# EAGLE design 10F 2V7 supercap (EAGLE 5.06)
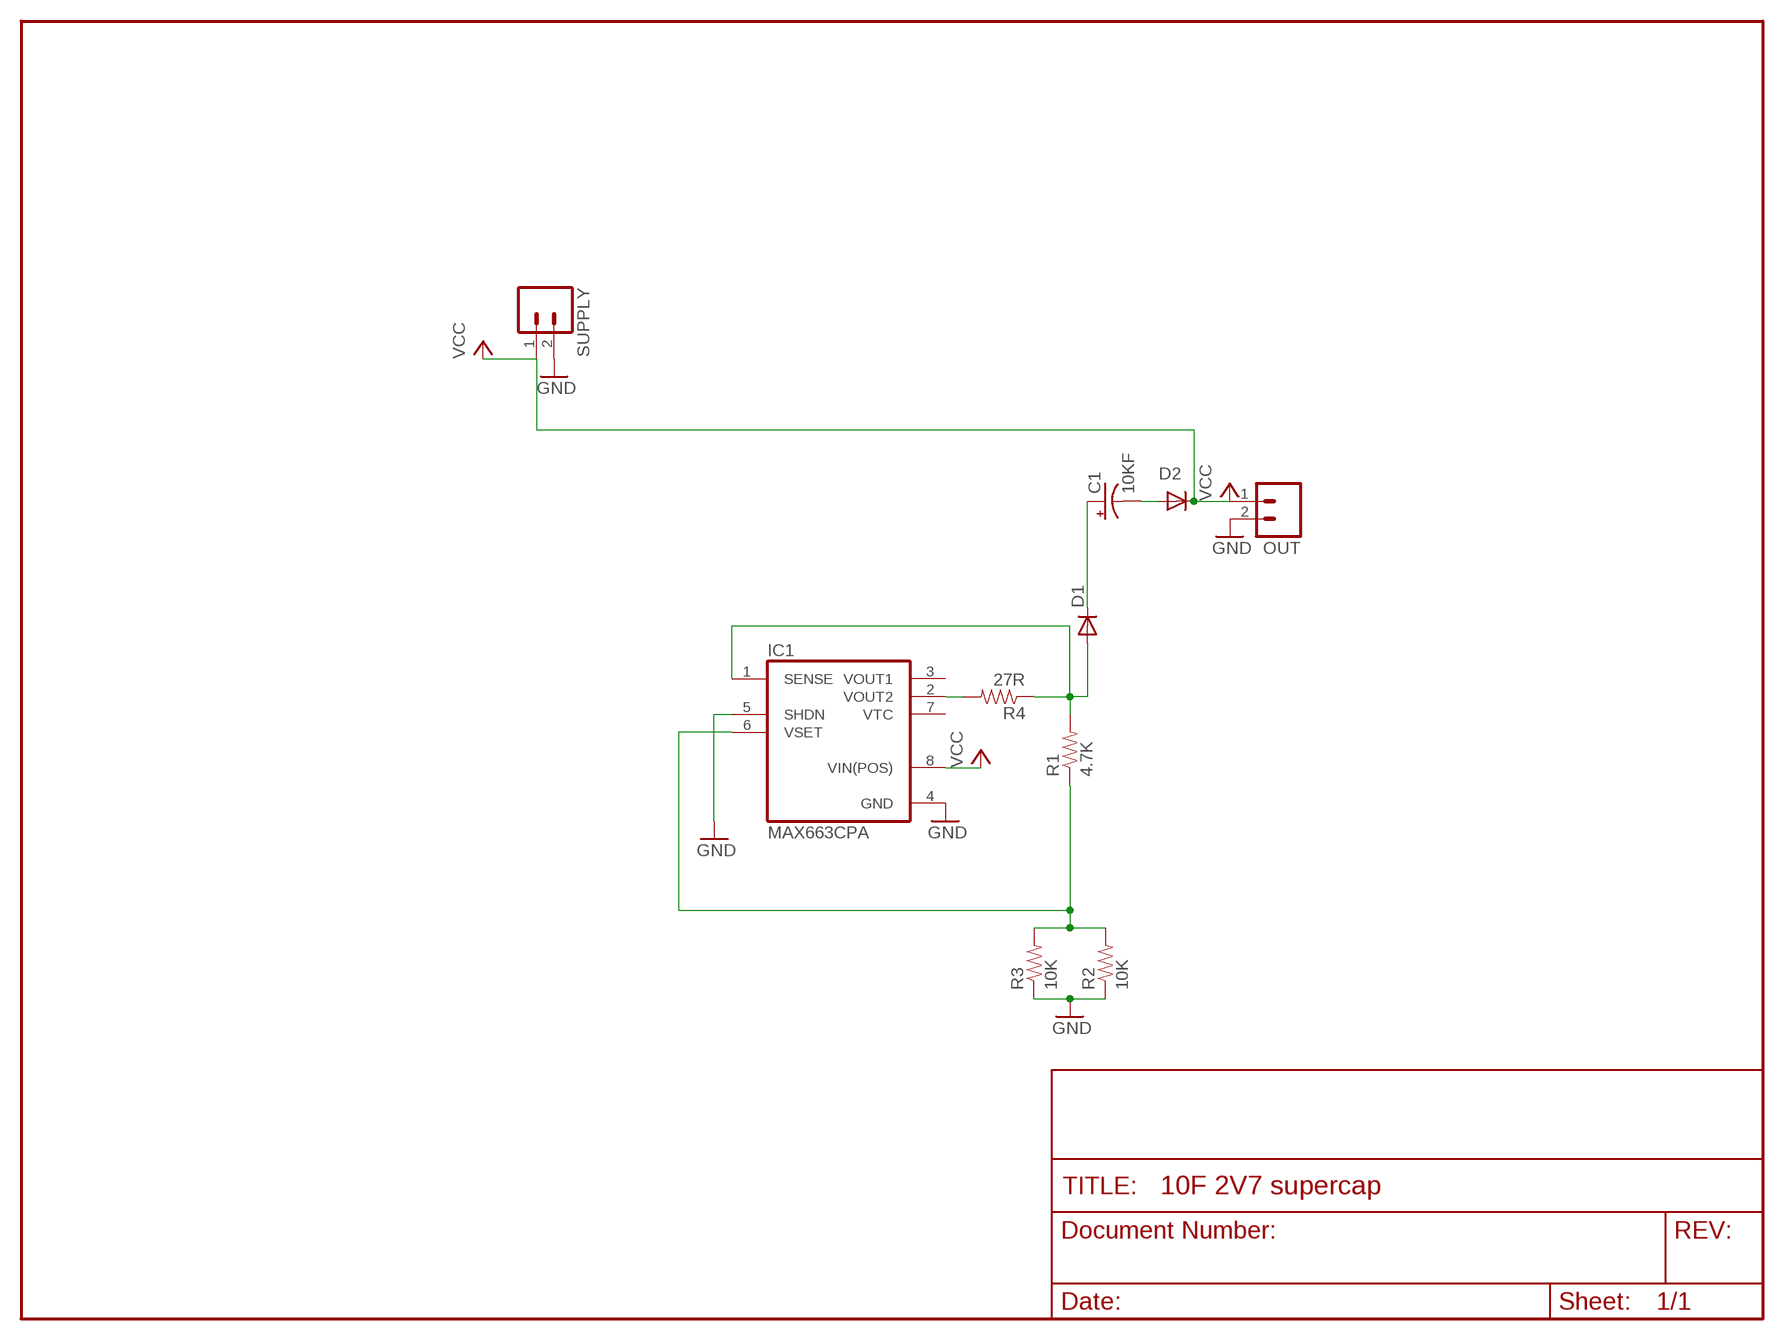
[diagram p0: schematic, sheet 1]

## Parts
C1  10KF  CAP_POLPTH3  [CPOL-RADIAL-1000UF-63V]
D1  DIODEPTH  [DIODE-1N4001]
D2  DIODEPTH  [DIODE-1N4001]
IC1  MAX663CPA  [DIL08]
OUT  M02LOCK  [1X02_LOCK]
R1  4.7K  RESISTORPTH1  [AXIAL-0.3]
R2  10K  RESISTORPTH1  [AXIAL-0.3]
R3  10K  RESISTORPTH1  [AXIAL-0.3]
R4  27R  RESISTORPTH1  [AXIAL-0.3]
SUPPLY  M02LOCK  [1X02_LOCK]

## Nets
GND: IC1.4(GND) IC1.5(SHDN) OUT.2 R2.P$1 R3.P$1 SUPPLY.2
N$1: IC1.2(VOUT2) R4.P$2
N$2: D1.A IC1.1(SENSE) R1.P$2 R4.P$1
N$3: C1.2(-) D2.A
N$4: IC1.6(VSET) R1.P$1 R2.P$2 R3.P$2
N$5: C1.1(+) D1.C
VCC: D2.C IC1.8(VIN(POS)) OUT.1 SUPPLY.1
Unconnected: IC1.3(VOUT1) IC1.7(VTC)

## Library data of the parts
C1 = SparkFun:CAP_POL: Capacitor Polarized These are standard SMD and PTH capacitors. Normally 10uF, 47uF, and 100uF in electrolytic and tantalum varieties. Always verify the external diameter of the through hole cap, it varies with capacity, voltage, and manufacturer. The EIA devices should be standard.
D1 D2 = SparkFun:DIODE: Diode These are standard reverse protection diodes and small signal diodes. SMA package can handle up to about 1A. SOD-323 can handle about 200mA. What the SOD-323 package when ordering, there are some mfgs out there that are 5-pin packages.
IC1 = maxim:MAX663CPA: Positive VOLTAGE REGULATOR
OUT SUPPLY = SparkFun:M02: Header 2 Standard 2-pin 0.1" header. Use with straight break away headers (SKU : PRT-00116), right angle break away headers (PRT-00553), swiss pins (PRT-00743), machine pins (PRT-00117), and female headers (PRT-00115). Molex polarized connector foot print use with SKU : PRT-08233 with associated crimp pins and housings.
R1-R4 = SparkFun:RESISTOR: Resistor Basic schematic elements and footprints for 0603, 1206, and PTH 1/10th watt (small) resistors.

## Board
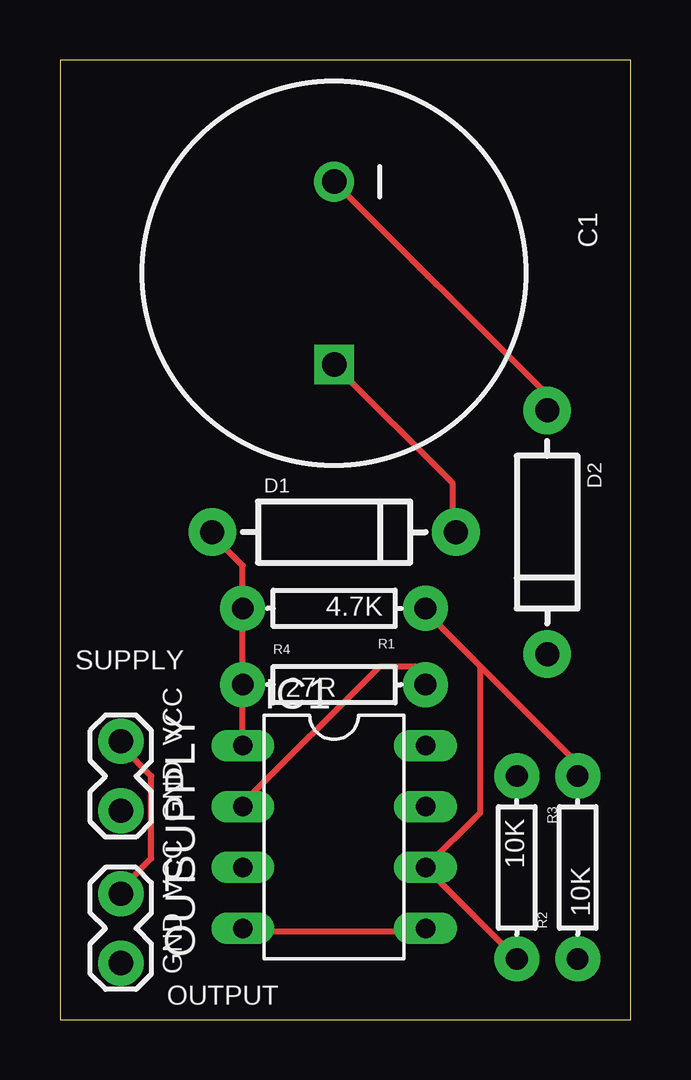
[diagram p1: board, top side]
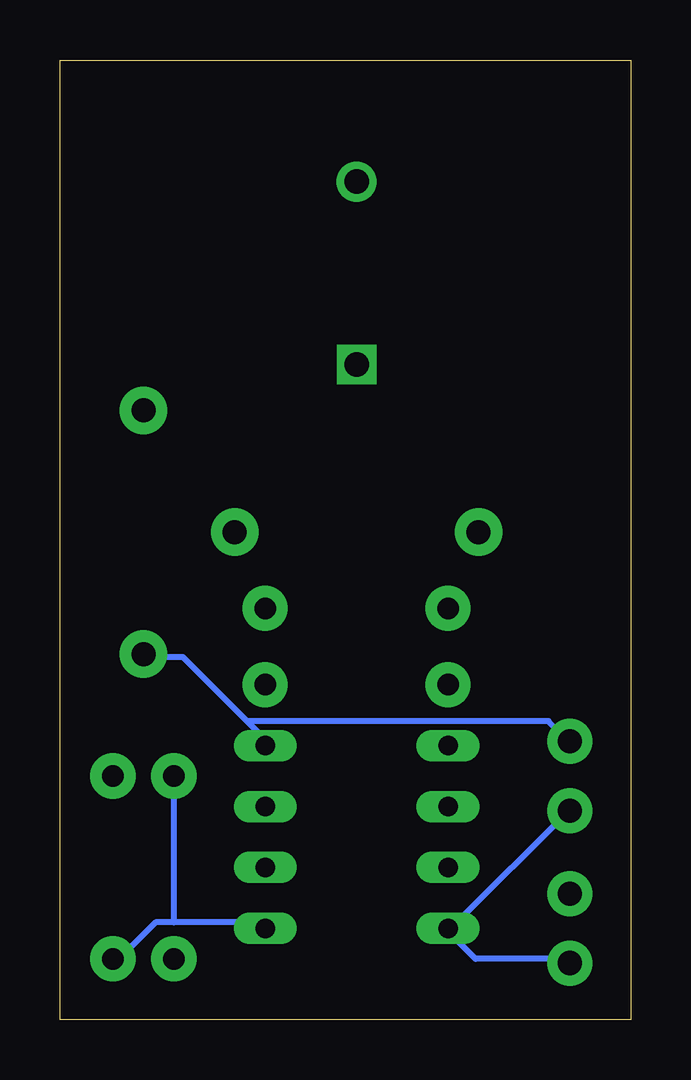
[diagram p2: board, bottom side, seen from below]

Size 23.8 x 39.99 mm. Coordinates in mm from the lower left corner, seen from the top.
Outline: 0,0 23.8,0 23.8,39.99 0,39.99 0,0
Copper layers (1*16): Top 0.035mm / dielectric 1.5mm / Bottom 0.035mm
Design rules "default": minimum track width 10mil, minimum drill 24mil, track to track 8mil, track to pad 8mil, pad to pad 8mil, via to via 8mil, smd to smd 8mil, copper to edge 40mil, drill to drill 8mil, minimum pad ring 10mil, minimum via ring 8mil, stop-mask expansion 4mil, vias tented up to drill 0mil, thermal gap 10mil

### Footprints (pad centres in the part's own frame; a part is rotated, then mirrored left to right if it is on the bottom)
CPOL-RADIAL-1000UF-63V = drill 1.016 pad 1.651 square: 1 3.81,0 | drill 1.016 pad 1.676 round: 2 -3.81,0
DIODE-1N4001 = drill 1 pad 1.981 round: A -5.08,0; C 5.08,0
DIL08 = drill 0.813 long: 1 -3.81,-3.81; 2 -1.27,-3.81; 3 1.27,-3.81; 4 3.81,-3.81; 5 3.81,3.81; 6 1.27,3.81; 7 -1.27,3.81; 8 -3.81,3.81
1X02_LOCK = drill 1.016 pad 1.88 round: 1 -0.178,0; 2 2.718,0
AXIAL-0.3 = drill 0.9 pad 1.88 round: P$1 -3.81,0; P$2 3.81,0

### Placement (x,y rotation side)
C1  11.43,31.11 270 top
D1  11.43,20.32 0 top
D2  20.32,20.32 270 top
IC1  11.43,7.62 270 top
OUT  2.54,5.08 270 top
R1  11.43,17.14 180 top
R2  21.59,6.35 90 top
R3  19.05,6.35 270 top
R4  11.43,13.97 0 top
SUPPLY  2.54,11.43 270 top

### Tracks (layer width: path | path; a pad name or v marks a point on that pad's centre or on a via)
GND
  Top 0.254: IC1.5 15.24,3.68 7.62,3.68 IC1.4
  Bottom 0.254: OUT.2 2.67,2.54 6.48,2.54 7.62,3.68 IC1.4 7.62,4.06 7.24,4.06 2.67,8.64 SUPPLY.2 | 19.05,4.06 15.24,4.06 IC1.5 | 19.05,4.06 19.81,4.06 21.34,2.54 R2.P$1 | 19.05,4.06 R3.P$1
N$1
  Top 0.254: R4.P$2 15.24,14.73 13.34,14.73 7.62,9.02 IC1.2
N$2
  Top 0.254: IC1.1 R4.P$1 R1.P$2 7.62,18.92 6.48,20.07 D1.A
N$3
  Top 0.254: C1.2 20.19,26.16 20.19,25.4 D2.A
N$4
  Top 0.254: R3.P$2 IC1.6 17.53,8.64 17.53,14.73 | 17.53,14.73 21.34,10.92 21.34,10.16 R2.P$2 | 17.53,14.73 15.24,17.02 R1.P$1
N$5
  Top 0.254: C1.1 16.38,22.35 16.38,20.45 D1.C
VCC
  Top 0.254: OUT.1 2.67,5.59 3.81,6.73 3.81,10.16 2.67,11.3 SUPPLY.1
  Bottom 0.254: 16,12.45 18.67,15.11 20.19,15.11 D2.C | 16,12.45 15.24,11.68 IC1.8 | 16,12.45 3.43,12.45 2.67,11.68 SUPPLY.1

### Text on the board
tPlace: SUPPLY | VCC | GND | VCC | GND | OUTPUT